# Altium schematic sheet 3_Communication.SchDoc
size A4; SheetNumber: 3; SheetTotal: 4
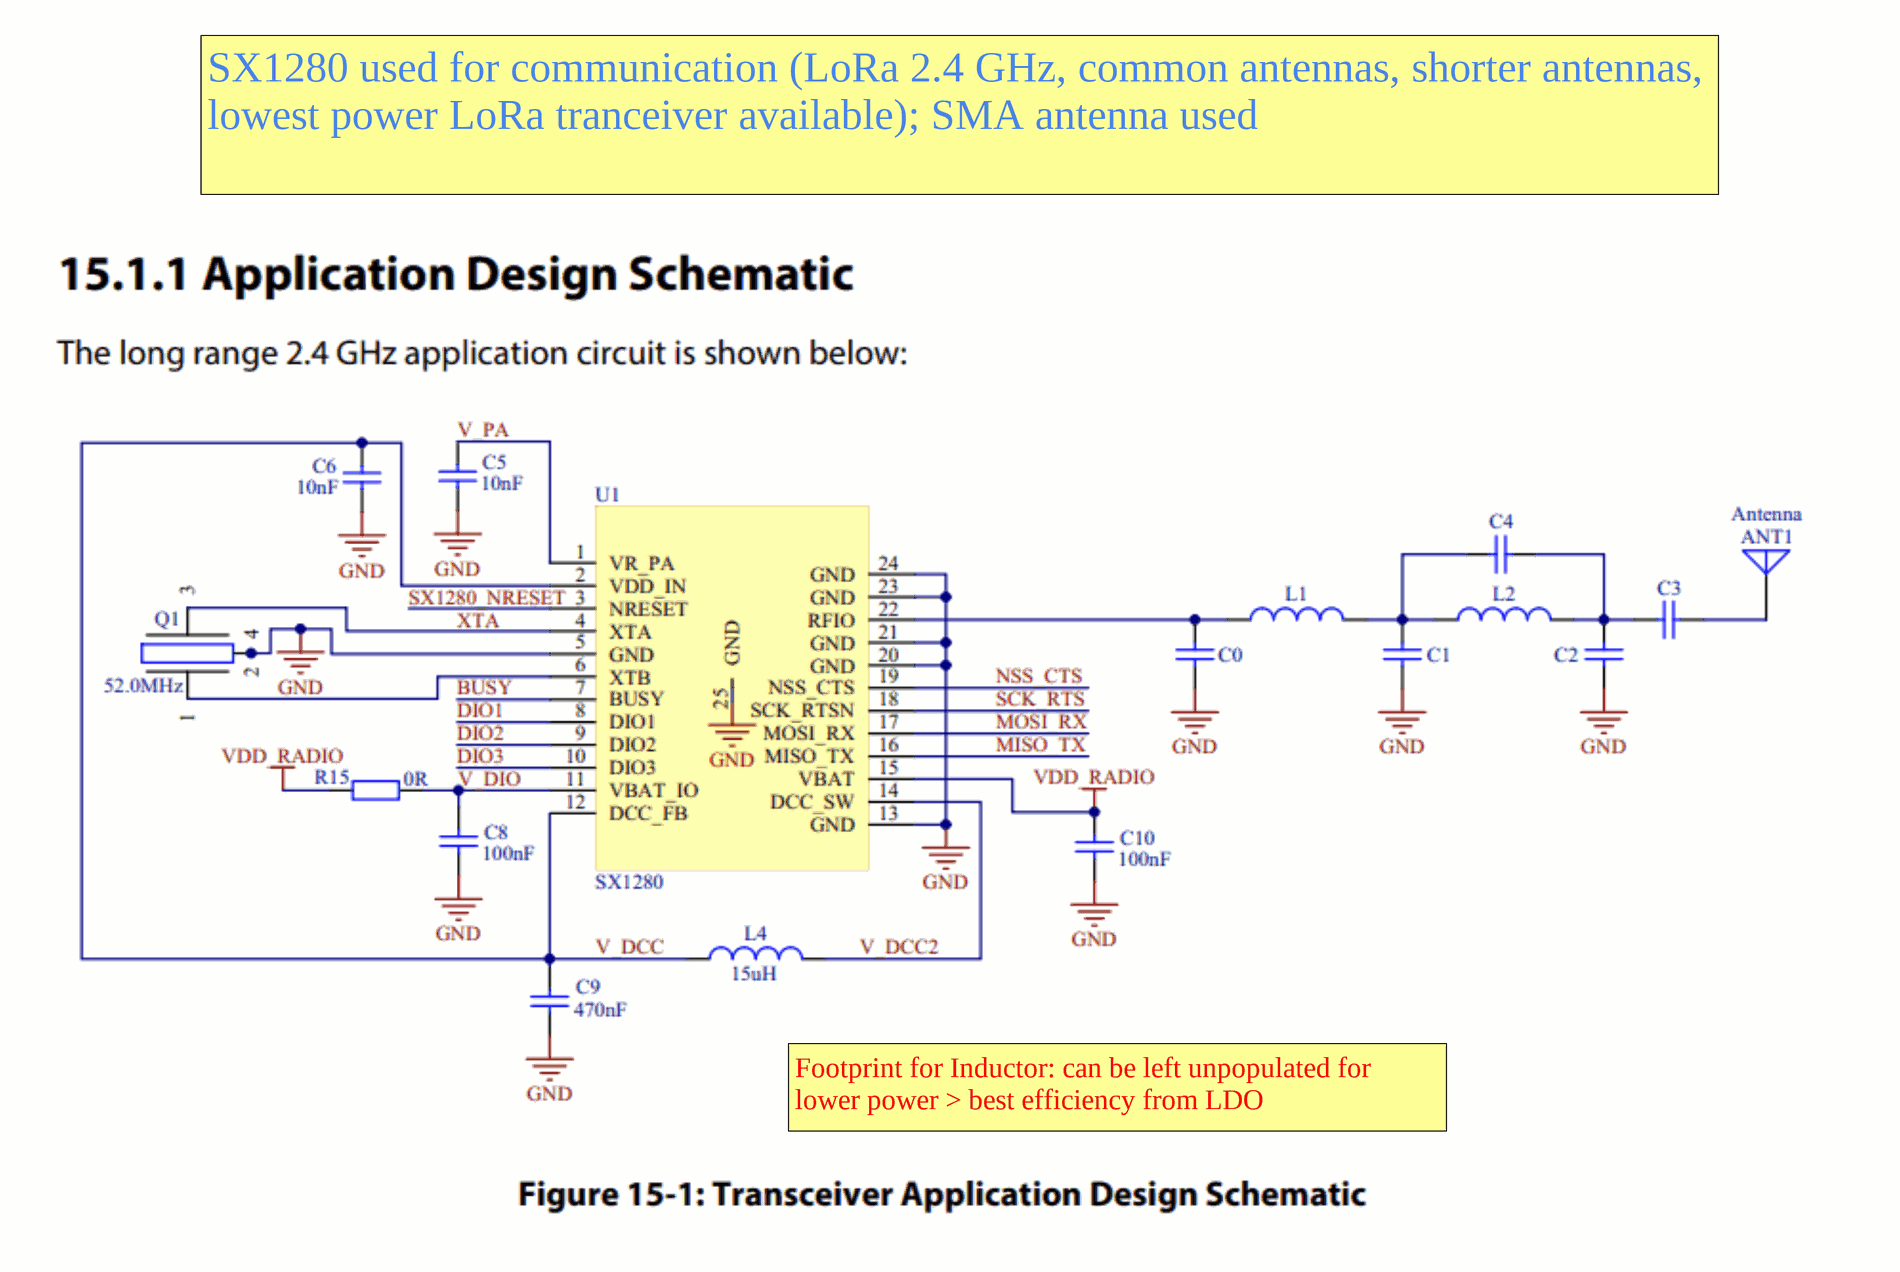
[diagram p0: 3_Communication.SchDoc, left]
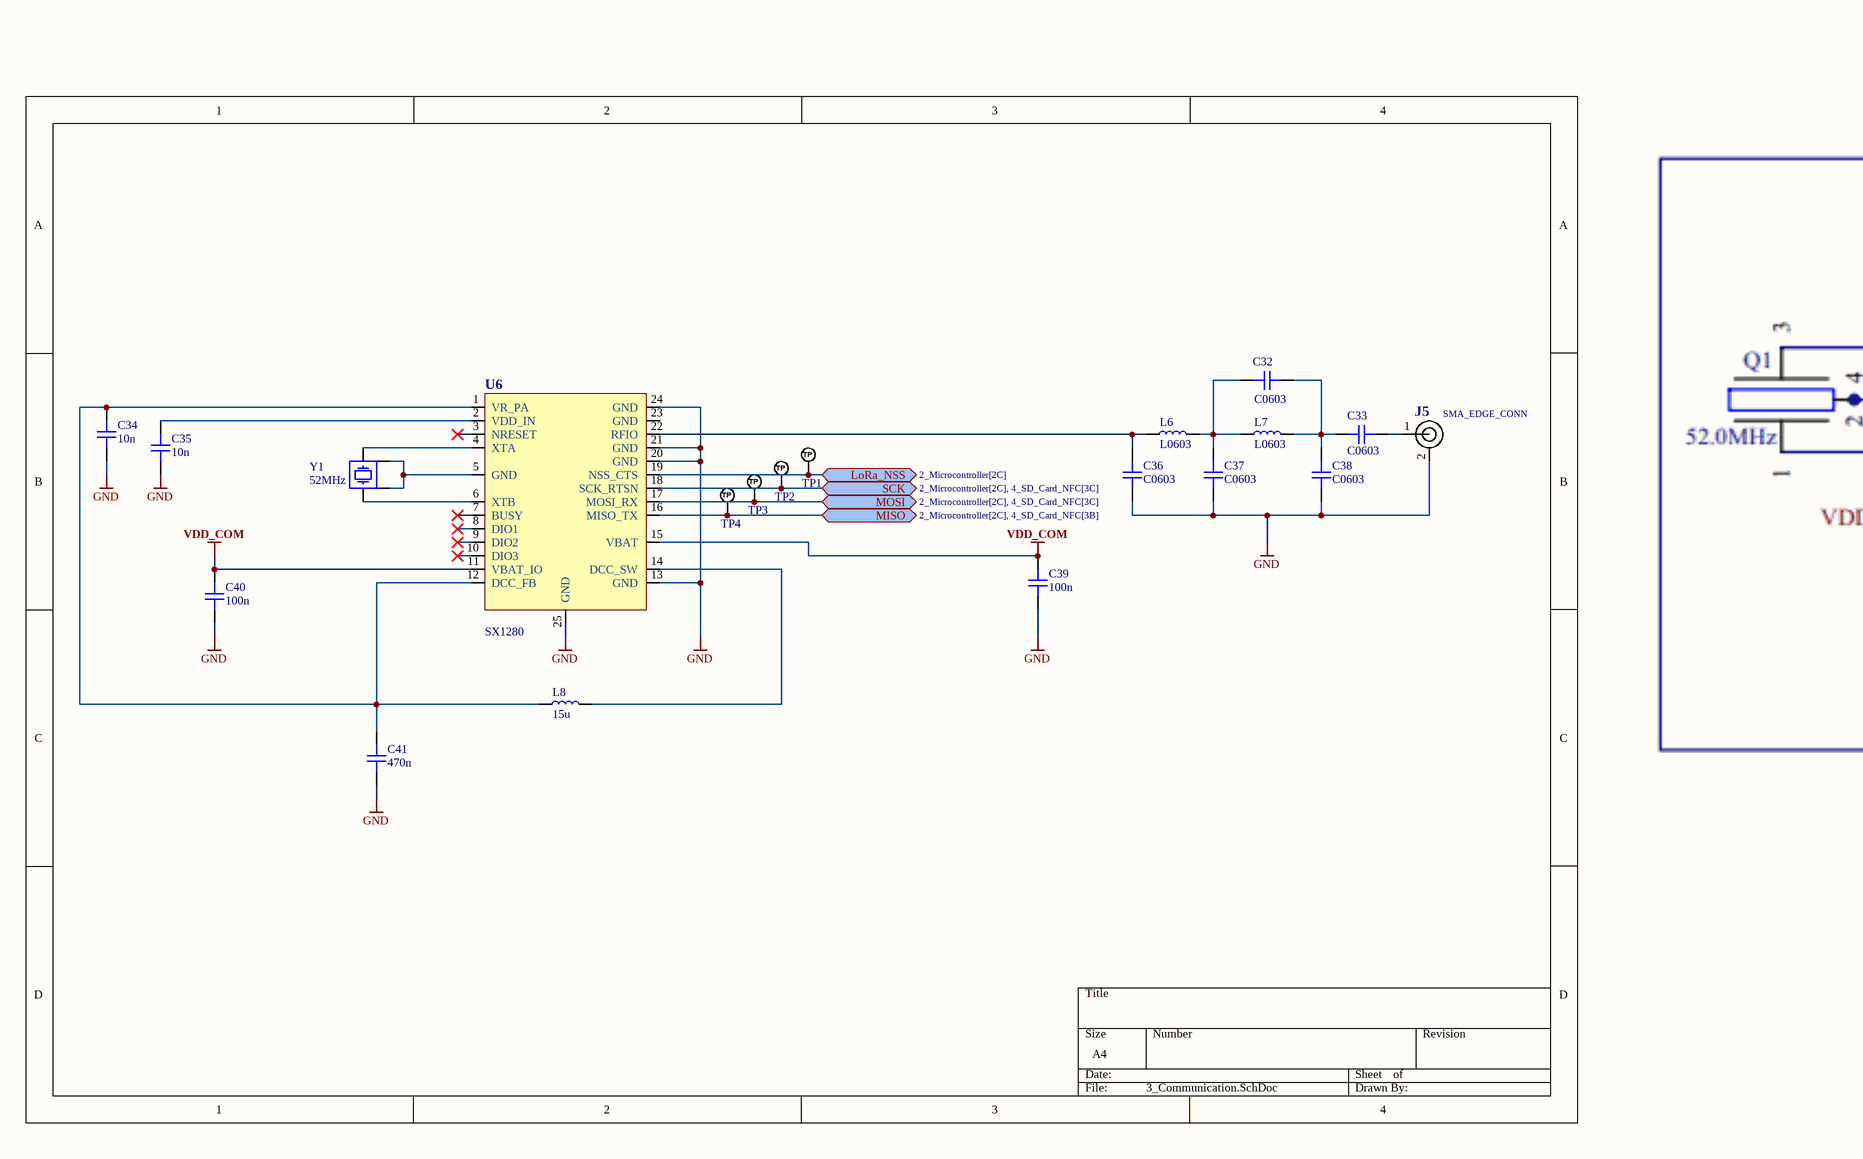
[diagram p1: 3_Communication.SchDoc, middle]
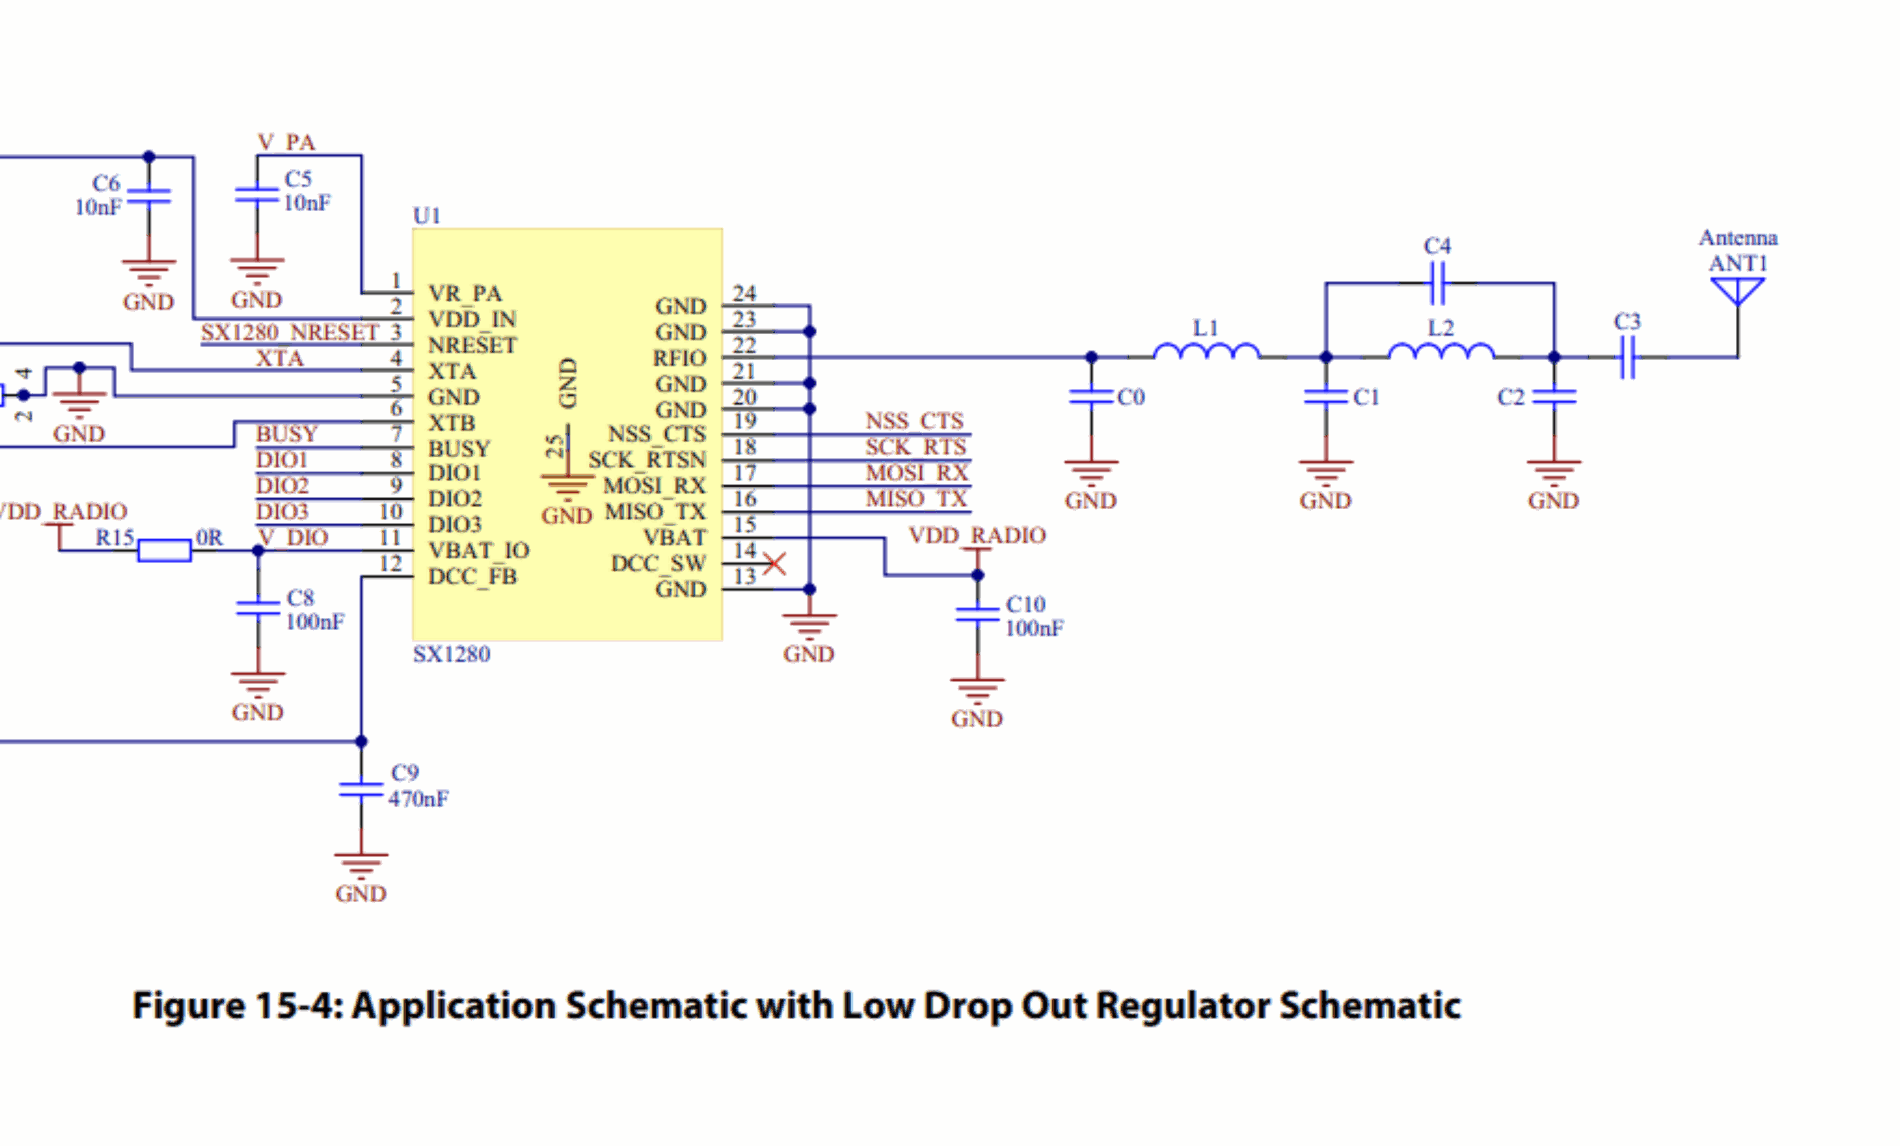
[diagram p2: 3_Communication.SchDoc, right]

## Parts
C32  C0603  [CAP_0603]
C33  C0603  [CAP_0603]
C34  10n  [CAP_0603]
C35  10n  [CAP_0603]
C36  C0603  [CAP_0603]
C37  C0603  [CAP_0603]
C38  C0603  [CAP_0603]
C39  100n  [CAP_0603]
C40  100n  [CAP_0603]
C41  470n  [CAP_0603]
J5  SMA_EDGE_CONN  [CON-SMA-EDGE-S]
L6  L0603  [IND_0603]
L7  L0603  [IND_0603]
L8  15u  [IND_0603]
TP1  TP_NOBOM  [PAD_RND_1MM]  (value not drawn)  (no BOM)
TP2  TP_NOBOM  [PAD_RND_1MM]  (value not drawn)  (no BOM)
TP3  TP_NOBOM  [PAD_RND_1MM]  (value not drawn)  (no BOM)
TP4  TP_NOBOM  [PAD_RND_1MM]  (value not drawn)  (no BOM)
U6  SX1280
Y1  52MHz  [XTAL_3225]

## Ports
LoRa_NSS (bidir, see 2_Microcontroller[2C]), MISO (bidir, see 2_Microcontroller[2C], 4_SD_Card_NFC[3B]), MOSI (bidir, see 2_Microcontroller[2C], 4_SD_Card_NFC[3C]), SCK (bidir, see 2_Microcontroller[2C], 4_SD_Card_NFC[3C])

## Nets
GND: C34.1 C35.1 C36.1 C37.1 C38.1 C39.1 C40.1 C41.1 J5.2 U6.13(GND) U6.20(GND) U6.21(GND) U6.24(GND) U6.25(GND)
VDD_COM: C39.2 C40.2 U6.11(VBAT_IO) U6.15(VBAT)
LoRa_NSS: TP1.1(TP) U6.19(NSS_CTS) ; port LoRa_NSS
MISO: TP4.1(TP) U6.16(MISO_TX) ; port MISO
MOSI: TP3.1(TP) U6.17(MOSI_RX) ; port MOSI
SCK: TP2.1(TP) U6.18(SCK_RTSN) ; port SCK
NetC32_1: C32.1 C33.2 C38.2 L7.2
NetC32_2: C32.2 C37.2 L6.2 L7.1
NetC33_1: C33.1 J5.1
NetC34_2: C34.2 C41.2 L8.1 U6.1(VR_PA) U6.12(DCC_FB)
NetC35_2: C35.2 U6.2(VDD_IN)
NetC36_2: C36.2 L6.1 U6.22(RFIO)
NetL8_2: L8.2 U6.14(DCC_SW)
NetU6_4: U6.4(XTA) Y1.3
NetU6_5: U6.5(GND) Y1.2 Y1.4
NetU6_6: U6.6(XTB) Y1.1

Not connected (* = marked no-connect by the designer): U6 3(NRESET)* 7(BUSY)* 8(DIO1)* 9(DIO2)* 10(DIO3)* 23(GND)

## Notes on the sheet
- SX1280 used for communication (LoRa 2.4 GHz, common antennas, shorter antennas, lowest power LoRa tranceiver available); SMA antenna used
- Values based on antenna input impedance; capacitors to ground can not be placed, inductors or series capacitors can be swaped with 0R resistors
- Footprint for Inductor: can be left unpopulated for lower power > best efficiency from LDO

## Library data of the parts
C32-C41 = CAP_0603: Capacitor SMD 0603; Manufacturer: *; Manufacturer Part Number: *; Distributor Link: *; LCSC: *; Rating: *; Dielectric: *
J5 = CON-SMA-EDGE-S: RF Connector SMA Female 50 Ohms 18 GHz PCB Edge Mount; Manufacturer: RF Solutions; Manufacturer Part Number: CON-SMA-EDGE-S
L6-L8 = IND_0603: Inductor SMD 0603
TP1-TP4 = TEST_POINT_RND_1MM: Test Point Round 1mm (NO BOM)
U6 = SX1280: Low power LoRa transceiver operating at 2.4GHz with ranging capability
Y1 = Crystal: Manufacturer: Epson; Manufacturer Part Number: TSX-3225 24.0000MF15X-AC